# Altium schematic sheet S1_Main.SchDoc: TPS65185 EVB
size A4; DrawnBy: LaserUFO; Revision: 1.0
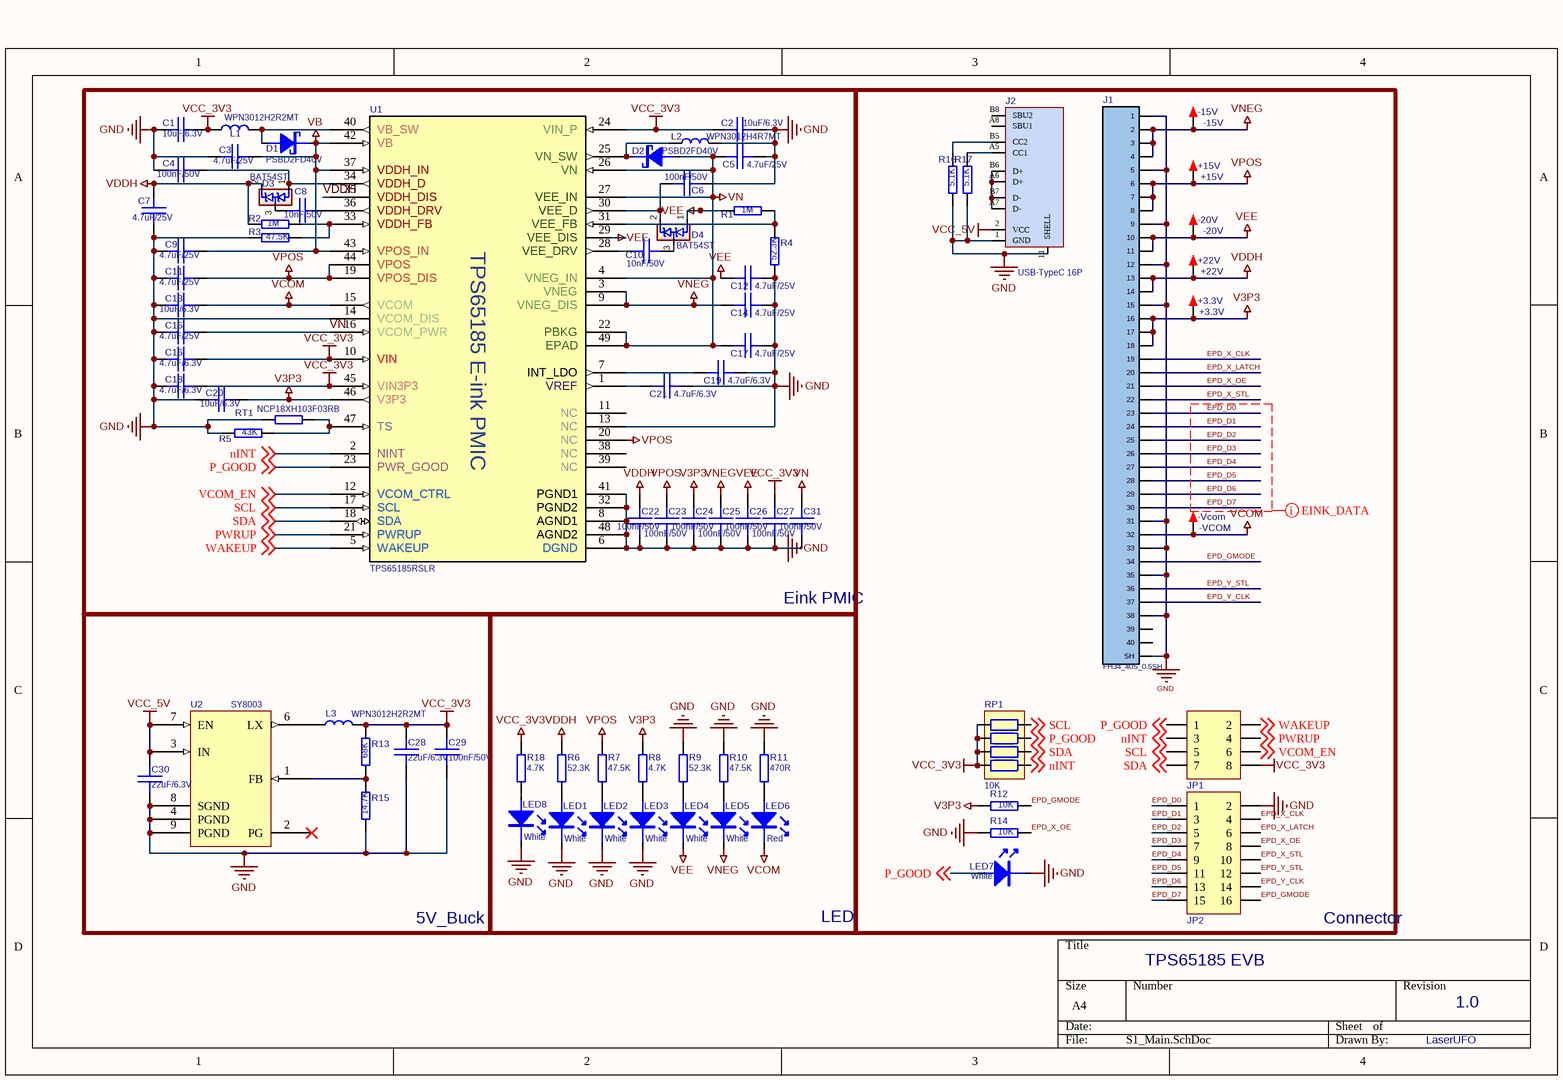
[diagram p0: S1_Main.SchDoc]

## Parts
+3.3V  +3.3V  [TEST 1.4]
+15V  +15V  [TEST 1.4]
+22V  +22V  [TEST 1.4]
-15V  -15V  [TEST 1.4]
-20V  -20V  [TEST 1.4]
-Vcom  -VCOM  [TEST 1.4]
C1  10uF/6.3V  [SMT_C_0402]
C2  10uF/6.3V  [SMT_C_0402]
C3  4.7uF/25V  [SMT_C_0603]
C4  100nF/50V  [SMT_C_0402]
C5  4.7uF/25V  [SMT_C_0603]
C6  100nF/50V  [SMT_C_0402]
C7  4.7uF/25V  [SMT_C_0603]
C8  10nF/50V  [SMT_C_0402]
C9  4.7uF/25V  [SMT_C_0603]
C10  10nF/50V  [SMT_C_0402]
C11  4.7uF/25V  [SMT_C_0603]
C12  4.7uF/25V  [SMT_C_0603]
C13  10uF/6.3V  [SMT_C_0402]
C14  4.7uF/25V  [SMT_C_0603]
C15  4.7uF/25V  [SMT_C_0603]
C16  4.7uF/6.3V  [SMT_C_0402]
C17  4.7uF/25V  [SMT_C_0603]
C18  4.7uF/6.3V  [SMT_C_0402]
C19  4.7uF/6.3V  [SMT_C_0402]
C20  10uF/6.3V  [SMT_C_0402]
C21  4.7uF/6.3V  [SMT_C_0402]
C22  100nF/50V  [SMT_C_0402]
C23  100nF/50V  [SMT_C_0402]
C24  100nF/50V  [SMT_C_0402]
C25  100nF/50V  [SMT_C_0402]
C26  100nF/50V  [SMT_C_0402]
C27  100nF/50V  [SMT_C_0402]
C28  22uF/6.3V  [SMT_C_0603]
C29  100nF/50V  [SMT_C_0402]
C30  22uF/6.3V  [SMT_C_0603]
C31  100nF/50V  [SMT_C_0402]
D1  PSBD2FD40V  [SMT_DIODE_DFN1006-2L(0402)]
D2  PSBD2FD40V  [SMT_DIODE_DFN1006-2L(0402)]
D3  BAT54ST  [SOT523/SC-75]
D4  BAT54ST  [SOT523/SC-75]
J1  FH34_40S_0.5SH  [FPC_0.5MM_40P_DNUP_FH34SRJ-40S-0.5SH]
J2  USB-TypeC 16P  [USB-TYPE_C-16P]
JP1  Header 4X2  [HDR2.54-WI-2x4P]  (value not drawn)
JP2  Header 8X2  [HDR2.54-WI-2x8P]  (value not drawn)
L1  WPN3012H2R2MT  [SMT_L_3mm]
L2  WPN3012H4R7MT  [SMT_L_3mm]
L3  WPN3012H2R2MT  [SMT_L_3mm]
LED1  White  [SMT_LED_0603_W]
LED2  White  [SMT_LED_0603_W]
LED3  White  [SMT_LED_0603_W]
LED4  White  [SMT_LED_0603_W]
LED5  White  [SMT_LED_0603_W]
LED6  Red  [SMT_LED_0603_W]
LED7  White  [SMT_LED_0603_W]
LED8  White  [SMT_LED_0603_W]
R1  1M  [SMT_R_0402]
R2  1M  [SMT_R_0402]
R3  47.5K  [SMT_R_0402]
R4  52.3K  [SMT_R_0402]
R5  43K  [SMT_R_0402]
R6  52.3K  [SMT_R_0402]
R7  47.5K  [SMT_R_0402]
R8  4.7K  [SMT_R_0402]
R9  52.3K  [SMT_R_0402]
R10  47.5K  [SMT_R_0402]
R11  470R  [SMT_R_0402]
R12  10K  [SMT_R_0402]
R13  68K  [SMT_R_0402]
R14  10K  [SMT_R_0402]
R15  14.7K  [SMT_R_0402]
R16  5.1K  [SMT_R_0402]
R17  5.1K  [SMT_R_0402]
R18  4.7K  [SMT_R_0402]
RP1  10K  [RCA-8P4R-0402]
RT1  NCP18XH103F03RB  [SMT_R_0603]
U1  TPS65185RSLR  [RSL48_4P4X4P4]
U2  SY8003  [DFN(PSON)8_50P200X65_HS-9N]

## Blocks framed on the sheet
Eink PMIC: C1-C27 C31 D1-D4 L1 L2 R1-R5 RT1 U1
Connector: +3.3V +15V +22V -15V -20V -Vcom J1 J2 JP1 JP2 LED7 R12 R14 R16 R17 RP1
5V_Buck: C28-C30 L3 R13 R15 U2

## Nets
GND: C1.1 C2.2 C3.2 C4.1 C5.2 C6.1 C7.2 C9.2 C11.2 C12.2 C13.2 C14.2 C15.2 C16.1 C17.2 C18.1 C19.2 C20.2 C21.2 C22.1 C23.1 C24.1 C25.1 C26.1 C27.1 C28.2 C29.2 C30.2 C31.1 J1.0(SH) J1.1 J1.5 J1.9 J1.12 J1.15 J1.31 J1.33 J1.35 J1.38 J2.1(GND) J2.11(SHELL) JP2.2 L2.1 LED1.2(K) LED2.2(K) LED3.2(K) LED7.2(K) LED8.2(K) R3.2 R4.2 R5.2 R9.1 R10.1 R11.1 R14.1 R15.2 R16.1 R17.1 RT1.1 U1.6(DGND) U1.8(AGND1) U1.13(NC) U1.14(VCOM_DIS) U1.32(PGND2) U1.41(PGND1) U1.48(AGND2) U2.4(PGND) U2.8(SGND) U2.9(PGND)
V3P3: +3.3V.1 C20.1 C24.2 J1.16 J1.17 J1.18 R8.1 R12.1 U1.46(V3P3)
VB: C3.1 C9.1 D1.2(K) U1.37(VDDH_IN) U1.42(VB) U1.43(VPOS_IN)
VCC_3V3: C1.2 C2.1 C16.2 C18.2 C27.2 C28.1 C29.1 JP1.8 L1.2 L3.1 R13.1 R18.1 RP1.5 RP1.6 RP1.7 RP1.8 U1.10(VIN) U1.24(VIN_P) U1.45(VIN3P3)
VCC_5V: C30.1 J2.2(VCC) U2.3(IN) U2.7(EN)
VCOM: -Vcom.1 C13.1 J1.32 LED6.2(K) U1.15(VCOM)
VDDH: +22V.1 C7.1 C22.2 D3.2 J1.13 J1.14 R2.2 R6.1 U1.35(VDDH_DIS)
VEE: -20V.1 C12.1 C26.2 D4.1 J1.10 J1.11 LED4.2(K) R1.1 U1.29(VEE_DIS)
VN: C5.1 C15.1 C17.1 C31.2 D2.1(A) U1.4(VNEG_IN) U1.16(VCOM_PWR) U1.22(PBKG) U1.26(VN) U1.27(VEE_IN) U1.49(EPAD)
VNEG: -15V.1 C14.1 C25.2 J1.2 J1.3 J1.4 LED5.2(K) U1.3(VNEG) U1.9(VNEG_DIS)
VPOS: +15V.1 C11.1 C23.2 J1.6 J1.7 J1.8 R7.1 U1.19(VPOS_DIS) U1.20(NC) U1.44(VPOS)
EPD_D0: J1.23 JP2.1
EPD_D1: J1.24 JP2.3
EPD_D2: J1.25 JP2.5
EPD_D3: J1.26 JP2.7
EPD_D4: J1.27 JP2.9
EPD_D5: J1.28 JP2.11
EPD_D6: J1.29 JP2.13
EPD_D7: J1.30 JP2.15
EPD_GMODE: J1.34 JP2.16 R12.2
EPD_X_CLK: J1.19 JP2.4
EPD_X_LATCH: J1.20 JP2.6
EPD_X_OE: J1.21 JP2.8 R14.2
EPD_X_STL: J1.22 JP2.10
EPD_Y_CLK: J1.37 JP2.14
EPD_Y_STL: J1.36 JP2.12
nINT: JP1.3 RP1.1 U1.2(NINT) ; off-sheet nINT
P_GOOD: JP1.1 LED7.1(A) RP1.3 U1.23(PWR_GOOD) ; off-sheet P_GOOD
PWRUP: JP1.4 U1.21(PWRUP) ; off-sheet PWRUP
SCL: JP1.5 RP1.4 U1.17(SCL) ; off-sheet SCL
SDA: JP1.7 RP1.2 U1.18(SDA) ; off-sheet SDA
VCOM_EN: JP1.6 U1.12(VCOM_CTRL) ; off-sheet VCOM_EN
WAKEUP: JP1.2 U1.5(WAKEUP) ; off-sheet WAKEUP
NetC4_2: C4.2 D3.1 U1.34(VDDH_D)
NetC6_2: C6.2 D4.2 U1.30(VEE_D)
NetC8_1: C8.1 U1.36(VDDH_DRV)
NetC8_2: C8.2 D3.3
NetC10_1: C10.1 D4.3
NetC10_2: C10.2 U1.28(VEE_DRV)
NetC19_1: C19.1 U1.7(INT_LDO)
NetC21_1: C21.1 U1.1(VREF)
NetD1_1: D1.1(A) L1.1 U1.40(VB_SW)
NetD2_2: D2.2(K) L2.2 U1.25(VN_SW)
NetJ2_A5: J2.A5(CC1) R17.2
NetJ2_A6: J2.A6(D+) J2.A7(D-) J2.B6(D+) J2.B7(D-)
NetJ2_B5: J2.B5(CC2) R16.2
NetL3_2: L3.2 U2.6(LX)
NetLED1_1: LED1.1(A) R6.2
NetLED2_1: LED2.1(A) R7.2
NetLED3_1: LED3.1(A) R8.2
NetLED4_1: LED4.1(A) R9.2
NetLED5_1: LED5.1(A) R10.2
NetLED6_1: LED6.1(A) R11.2
NetLED8_1: LED8.1(A) R18.2
NetR1_2: R1.2 R4.1 U1.31(VEE_FB)
NetR2_1: R2.1 R3.1 U1.33(VDDH_FB)
NetR5_1: R5.1 RT1.2 U1.47(TS)
NetR13_2: R13.2 R15.1 U2.1(FB)

Not connected (* = marked no-connect by the designer): J1 39 40; J2 A8(SBU1) B8(SBU2); U1 11(NC) 38(NC) 39(NC); U2 2(PG)*

## Layout directives
net class EINK_DATA: EPD_D0, EPD_D1, EPD_D2, EPD_D3, EPD_D4, EPD_D5, EPD_D6, EPD_D7

## Notes on the sheet
- LED
- (in symbol TPS65185RSLR) TPS65185 E-ink PMIC

## Library data of the parts
+3.3V +15V +22V -15V -20V -Vcom = TEST: 测试点; 版权归属: 源创客; BOM名称: 测试点; 学习资源: www.ooocke.com
C1-C27 C29 C31 = SMT_C: SMT MLCC Capacitor
C28 C30 = SMT_C_0603: Surface mount capacitor 0603
D1 D2 = SMT_DIODE_SCHOTTKY: SMT Schottky diode
D3 D4 = SMT_DualDiode_BAT54S: Dual Schottky Diode_BAT54S
J1 = CON40_FPC_0.5
J2 = USB_Type_C_2.0_16P: USB TypeC female SMT with 4 fixed foot
JP1 = Header 4X2: 4*2P接插件; 版权归属: 源创客; BOM名称: 4*2P接插件; 学习资源: www.ooocke.com
JP2 = Header 8X2: 8*2P接插件; 版权归属: 源创客; BOM名称: 8*2P接插件; 学习资源: www.ooocke.com
L1 L2 = SMT_L: SMT Inductor
L3 = SMT_L_3.0mm: SMT Power Inductor, 3.3x3.3x1mm
LED1-LED8 = SMT_LED: SMT LED
R1-R5 R12 R14 R16 R17 RT1 = SMT_R: SMT Resistor
R6-R11 R13 R15 R18 = SMT_R_0402: Surface mount resistor 0402
RP1 = R-8P4R: 贴片网络排阻; 版权归属: 源创客; BOM名称: 贴片网络排阻; 学习资源: www.ooocke.com
U1 = TPS65185RSLR: PMIC for E-Ink?Vizplex?Enabled Electronic Paper Display, with Active Discharge; Manufacturer_Part_Number: TPS651851RSLR; Vendor: Texas Instruments; PACKAGE_DESIGNATOR: RSL; PIN_COUNT: 48; FAMILY_NAME: LCD/OLED DISPLAY BIAS SOLUTIONS; INDUSTRY_STD_PKG_TYPE: VQFN; GENERIC_PART_NUMBER: TPS65185; Datasheet_URL: http://www.ti.com/lit/gpn/TPS65185; Manufacturer: Texas Instruments; Copyright: Copyright (C) 2018 Accelerated Designs. All rights reserved; RefDes: RefDes; Type: DEV
U2 = SY8003: High Efficiency 5.5V, 3A continuous, 1MHz / Synchronous Step Down Regulator